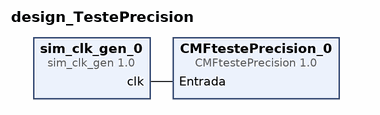
[diagram p0: block diagram of the top level]
# Vivado block design design_TestePrecision, xc7z020clg484-1, Vivado 2018.3
create_bd_design design_TestePrecision

create_bd_cell -type ip -vlnv xilinx.com:ip:sim_clk_gen:1.0 sim_clk_gen_0
set_property -dict {CONFIG.FREQ_HZ 10000000 CONFIG.RESET_POLARITY ACTIVE_HIGH} [get_bd_cells sim_clk_gen_0]
create_bd_cell -type ip -vlnv xilinx.com:user:CMFtestePrecision:1.0 CMFtestePrecision_0

# ---- connections ----

connect_bd_net [get_bd_pins sim_clk_gen_0/clk] [get_bd_pins CMFtestePrecision_0/Entrada]

validate_bd_design
save_bd_design
